# Altium project Auxiliary PCB.PrjPcb
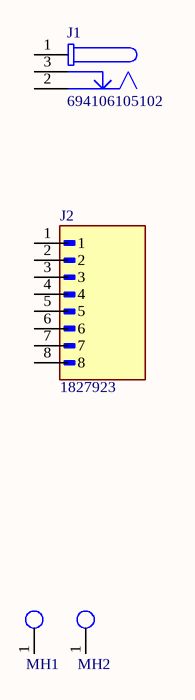
[diagram p0: Power and Signal IO.SchDoc]
1 sheet, 4 parts. Net scope: global (net labels, ports and power ports of the same name join across sheets).
Board file: Aux PCB.PcbDoc

## Sheet Power and Signal IO.SchDoc
size A; SheetNumber: 1; SheetTotal: 1

### Parts
J1  694106105102  [694106105102]
J2  1827923  [PHOENIX_1827923]
MH1  HOLE_128  [HOLE_128]  (value not drawn)  (no BOM)
MH2  HOLE_128  [HOLE_128]  (value not drawn)  (no BOM)

### Nets

Not connected (* = marked no-connect by the designer): J1 1 2 3; J2 1 2 3 4 5 6 7 8; MH1 1; MH2 1

### Library data of the parts
J1 = CMP-1502-00176-2: NexarPartId: 52645183; Insulation Resistance: 100MΩ; Operating Supply Voltage: 24V; Shielding: Unshielded; Gender: Male; Current Rating: 5A; Number of Contacts: 3; Connector Type: Power; Color: Black; Contact Plating: Tin; Min Operating Temperature: -40°C; Flammability Rating: UL94 V-0; Voltage Rating: 24V; Voltage Rating (DC): 24V; Contact Material: Gold; Contact Gender: Female; Packaging: Tape and Reel; Mount: Surface Mount; Height: 11.2mm; Housing Material: Polyamide; REACH SVHC: Unknown; Max Operating Temperature: 85°C; RoHS: Compliant; Termination: SMD/SMT
J2 = 1827923: Pluggable Header 3.81mm 16AWG 160V 8A 8 Position COMBICON MC Series | Phoenix Contact 1827923; SnapEDA_Link: https://www.snapeda.com/parts/1827923/Phoenix+Contact/view-part/?ref=snap; Package: None; Value: *; MF: Phoenix Contact; MP: 1827923; Check_prices: https://www.snapeda.com/parts/1827923/Phoenix+Contact/view-part/?ref=eda
MH1 MH2 = HOLE_128: 0.128 mounting hole, clearance for 4-40